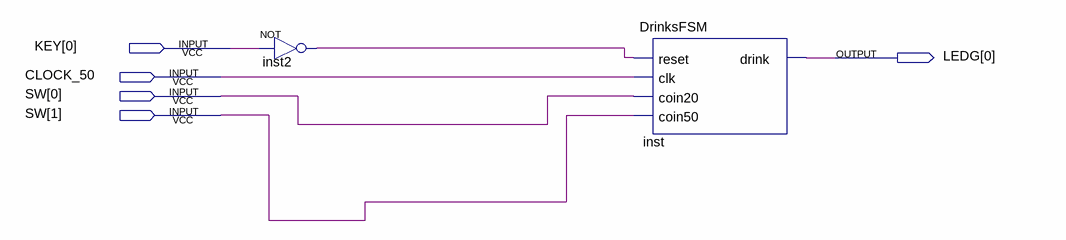
[diagram p0: schematic sheet]
// Quartus schematic DrinksMachine.bdf as structural Verilog: 2 symbols, 5 pins
module DrinksMachine (
  input  [0:0] KEY,
  input  CLOCK_50,
  input  [1:0] SW,
  output [0:0] LEDG
);

  wire inst2_out;

  not inst2 (inst2_out, KEY[0]);
  DrinksFSM inst (.reset(inst2_out), .clk(CLOCK_50), .coin20(SW[0]), .coin50(SW[1]), .drink(LEDG[0]));
endmodule
